# EAGLE schematic SWITCHBOARD (EAGLE 7.4.0)
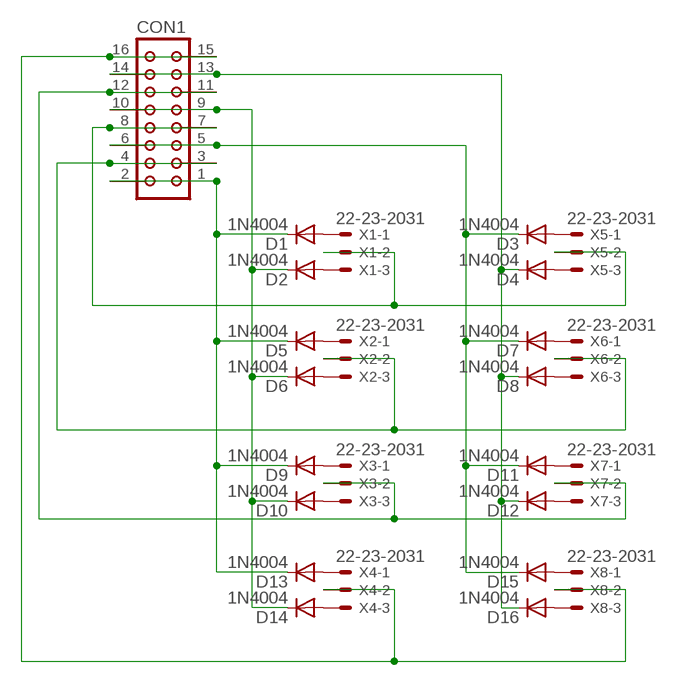
[diagram p0: schematic, sheet 1]

## Parts
CON1  CON16  [CON16]
D1  1N4004  [DO41-10]
D2  1N4004  [DO41-10]
D3  1N4004  [DO41-10]
D4  1N4004  [DO41-10]
D5  1N4004  [DO41-10]
D6  1N4004  [DO41-10]
D7  1N4004  [DO41-10]
D8  1N4004  [DO41-10]
D9  1N4004  [DO41-10]
D10  1N4004  [DO41-10]
D11  1N4004  [DO41-10]
D12  1N4004  [DO41-10]
D13  1N4004  [DO41-10]
D14  1N4004  [DO41-10]
D15  1N4004  [DO41-10]
D16  1N4004  [DO41-10]
X1  22-23-2031  [22-23-2031]
X2  22-23-2031  [22-23-2031]
X3  22-23-2031  [22-23-2031]
X4  22-23-2031  [22-23-2031]
X5  22-23-2031  [22-23-2031]
X6  22-23-2031  [22-23-2031]
X7  22-23-2031  [22-23-2031]
X8  22-23-2031  [22-23-2031]

## Nets
N$1: D1.A X1.1
N$2: D2.A X1.3
N$3: D3.A X5.1
N$4: D4.A X5.3
N$5: D5.A X2.1
N$6: D6.A X2.3
N$7: D7.A X6.1
N$8: D8.A X6.3
N$9: D9.A X3.1
N$10: D10.A X3.3
N$11: D11.A X7.1
N$12: D12.A X7.3
N$13: D13.A X4.1
N$14: D14.A X4.3
N$15: D15.A X8.1
N$16: D16.A X8.3
N$17: CON1.9 CON1.10 D2.C D6.C D10.C D14.C
N$18: CON1.1 CON1.2 D1.C D5.C D9.C D13.C
N$20: CON1.13 CON1.14 D4.C D8.C D12.C D16.C
N$21: CON1.7 CON1.8 X1.2 X5.2
N$22: CON1.3 CON1.4 X2.2 X6.2
N$23: CON1.11 CON1.12 X3.2 X7.2
N$24: CON1.15 CON1.16 X4.2 X8.2
N$26: CON1.5 CON1.6 D3.C D7.C D11.C D15.C

## Library data of the parts
CON1 = con-harting:CON16: CONNECTOR; OC_FARNELL: unknown; OC_NEWARK: unknown
D1-D16 = adafruit:1N4004: DIODE General purpose 1N400x type rectifier (With bigger pads) http://www.ladyada.net/library/pcb/eaglelibrary.html
X1-X8 = con-molex:22-23-2031: .100" (2.54mm) Center Header - 3 Pin; MF: MOLEX; MPN: 22-23-2031; OC_FARNELL: 1462950; OC_NEWARK: 30C0862